# EAGLE design micro_sd_breakout (EAGLE 6.5.0)
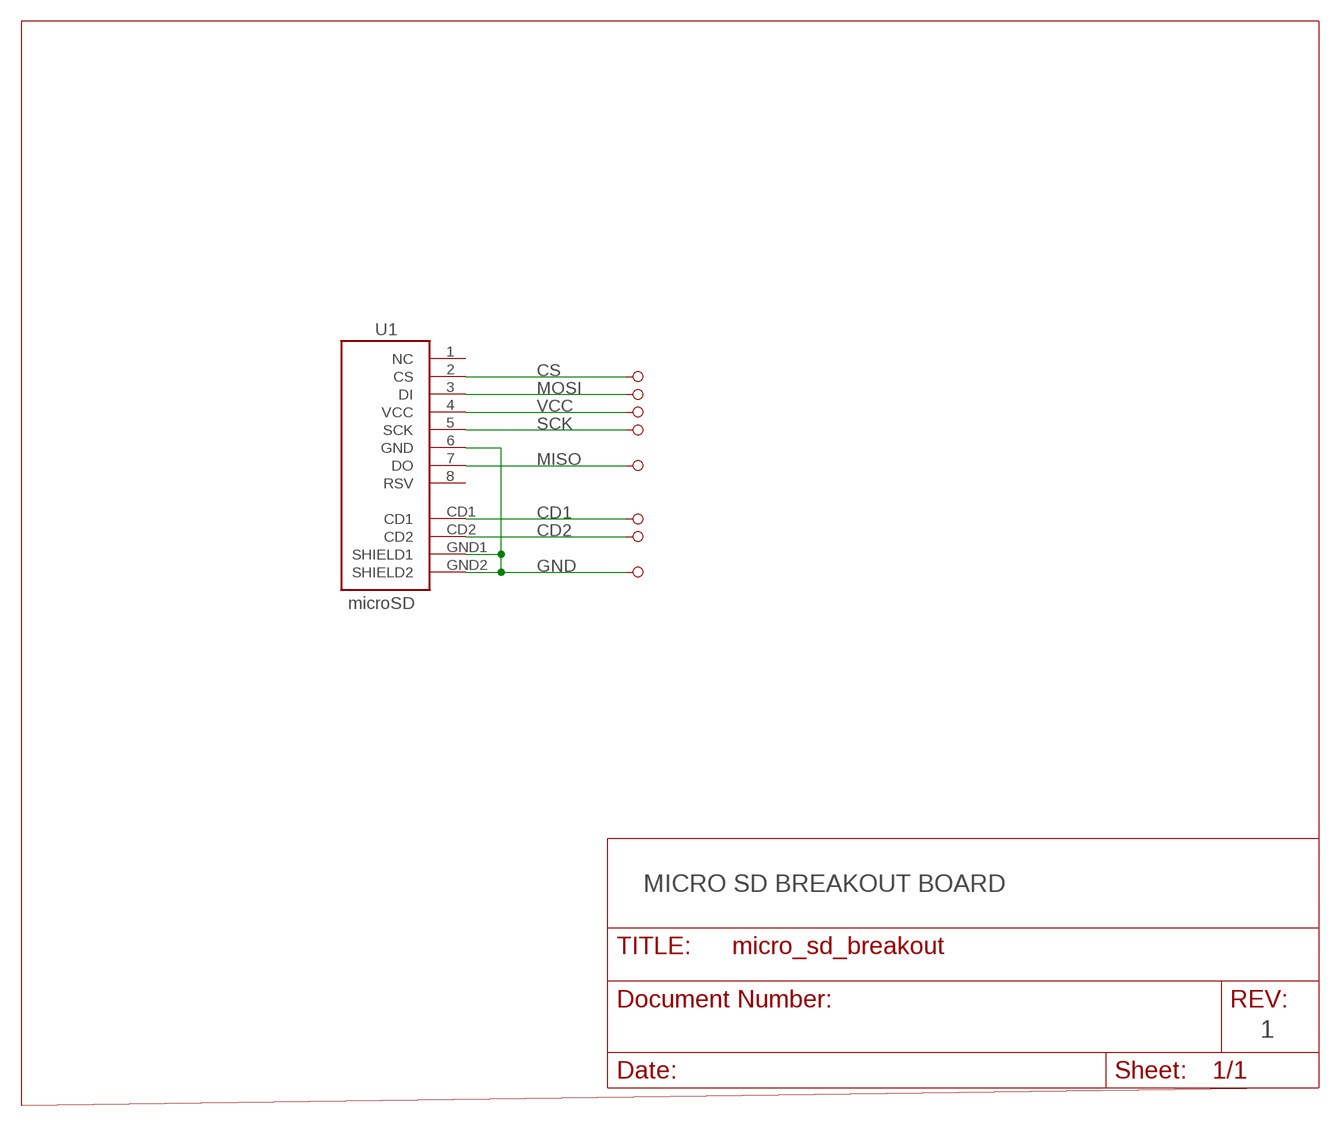
[diagram p0: schematic, sheet 1]

## Parts
JP1  PINHD-1X1  [1X01]
JP2  PINHD-1X1  [1X01]
JP3  PINHD-1X1  [1X01]
JP4  PINHD-1X1  [1X01]
JP5  PINHD-1X1  [1X01]
JP6  PINHD-1X1  [1X01]
JP7  PINHD-1X1  [1X01]
JP8  PINHD-1X1  [1X01]
U1  microSD  USD-SOCKETSMD  [MICRO-SD-SOCKET-PP]

## Nets
CD1: JP6.1 U1.CD1
CD2: JP7.1 U1.CD2
CS: JP1.1 U1.2(CS)
GND: JP8.1 U1.6(GND) U1.GND1(SHIELD1) U1.GND2(SHIELD2)
MISO: JP5.1 U1.7(DO)
MOSI: JP2.1 U1.3(DI)
SCK: JP4.1 U1.5(SCK)
VCC: JP3.1 U1.4(VCC)
Unconnected: U1.1(NC) U1.8(RSV)

## Notes on the sheet
- MICRO SD BREAKOUT BOARD
- 1

## Library data of the parts
JP1-JP8 = atmega328_breakout:PINHD-1X1: PIN HEADER
U1 = SparkFun:USD-SOCKET: microSD Socket Push-push type uSD socket. Schematic element and footprint production proven. Spark Fun Electronics SKU : PRT-00127. tDoc lines correctly indicate media card edge positions when inserting (unlocked, locked, depressed).

## Board
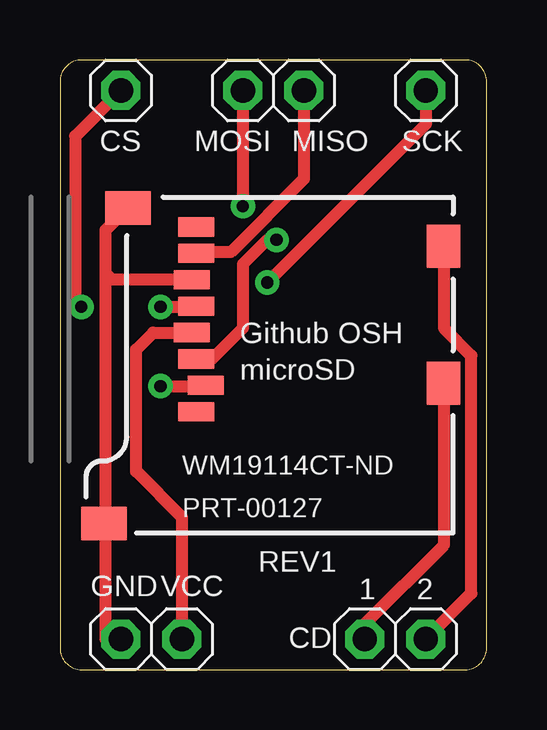
[diagram p1: board, top side]
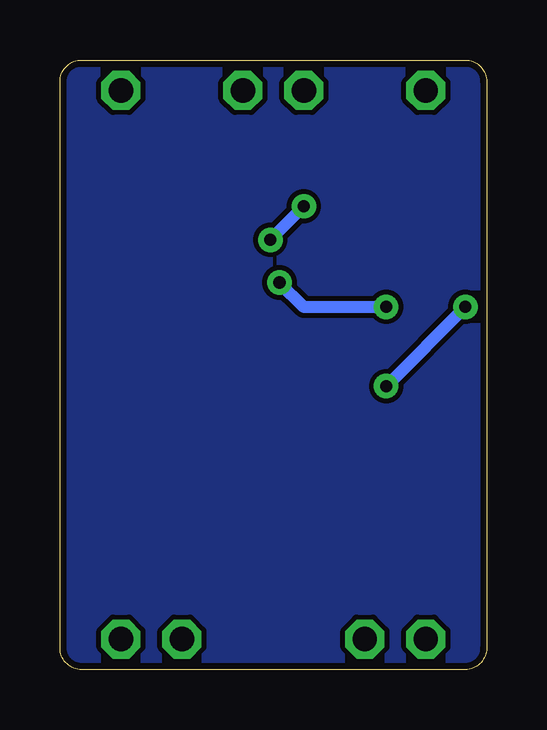
[diagram p2: board, bottom side, seen from below]

Size 17.78 x 25.4 mm. Coordinates in mm from the lower left corner, seen from the top.
Outline: 0,24.5 0,0.9 arc90 0.9,0 16.88,0 arc90 17.78,0.9 17.78,24.5 arc90 16.88,25.4 0.9,25.4 arc90 0,24.5
Copper layers (1*16): Top 0.035mm / dielectric 1.5mm / Bottom 0.035mm
Design rules "SparkFun *": minimum track width 20mil, minimum drill 20mil, track to track 8mil, track to pad 8mil, pad to pad 8mil, via to via 8mil, smd to smd 8mil, copper to edge 10mil, drill to drill 8mil, minimum pad ring 12mil, minimum via ring 10mil, stop-mask expansion 4mil, vias tented up to drill 20mil, thermal gap 10mil

### Footprints (pad centres in the part's own frame; a part is rotated, then mirrored left to right if it is on the bottom)
1X01 = drill 1.016 octagon: 1 0,0
MICRO-SD-SOCKET-PP = smd 0.8 x 1.5: 1 -8.94,10.7; 2 -7.84,10.3; 3 -6.74,10.7; 4 -5.64,10.9; 5 -4.54,10.7; 6 -3.44,10.9; 7 -2.34,10.7; 8 -1.24,10.7 | smd 1.8 x 1.4: CD1 -7.75,0.4; CD2 -2.05,0.4 | smd 1.4 x 1.9: GND1 -13.6,14.55; GND2 -0.45,13.55

### Placement (x,y rotation side)
JP1  2.54,24.13 0 top
JP2  7.62,24.13 0 top
JP3  5.08,1.27 0 top
JP4  15.24,24.13 0 top
JP5  10.16,24.13 0 top
JP6  12.7,1.27 0 top
JP7  15.24,1.27 0 top
JP8  2.54,1.27 0 top
U1  16.38,19.68 90 top

### Tracks (layer width: path | path; a pad name or v marks a point on that pad's centre or on a via)
CD1
  Top 0.508: JP6.1 12.7,1.9 16,5.21 16,11.81 U1.CD1
CD2
  Top 0.508: JP7.1 17.14,3.18 17.14,13.08 16,14.22 16,17.53 U1.CD2
CS  (via drill 0.51)
  Top 0.508: v4.19,11.81 5.97,11.81 U1.2 | v0.89,15.11 0.64,15.37 0.64,22.23 JP1.1
  Bottom 0.508: v0.89,15.11 v4.19,11.81
GND
  Top 0.508: JP8.1 1.91,1.27 1.91,6.1 | 1.91,6.1 1.91,16.51 | 1.91,16.51 1.91,18.31 U1.GND2 | U1.6 2.17,16.25 1.91,16.51 | U1.GND1 1.78,6.1 1.91,6.1
MISO
  Top 0.508: JP5.1 10.16,20.45 7.11,17.4 5.71,17.4 U1.7
MOSI  (via drill 0.51)
  Top 0.508: v9.02,17.91 8.64,17.91 7.62,16.89 7.62,14.22 6.35,12.95 5.71,12.95 U1.3 | JP2.1 v7.62,19.3
  Bottom 0.508: v7.62,19.3 v9.02,17.91
N$1
  pour Bottom: 0,25.4 17.78,25.4 17.78,0.13 0,0.13
SCK  (via drill 0.51)
  Top 0.508: v4.19,15.11 5.59,15.11 U1.5 | v8.64,16.13 15.24,22.73 JP4.1
  Bottom 0.508: v4.19,15.11 7.62,15.11 v8.64,16.13
VCC
  Top 0.508: U1.4 3.88,14.04 3.17,13.34 3.17,8.26 5.08,6.35 JP3.1

### Text on the board
tPlace: CS | MOSI | MISO | SCK | Github OSH | microSD | WM19114CT-ND | PRT-00127 | REV1 | GND | VCC | 1 | 2 | CD